# Altium schematic sheet ESP32C3.SchDoc
size A3; SheetNumber: 2; SheetTotal: 3
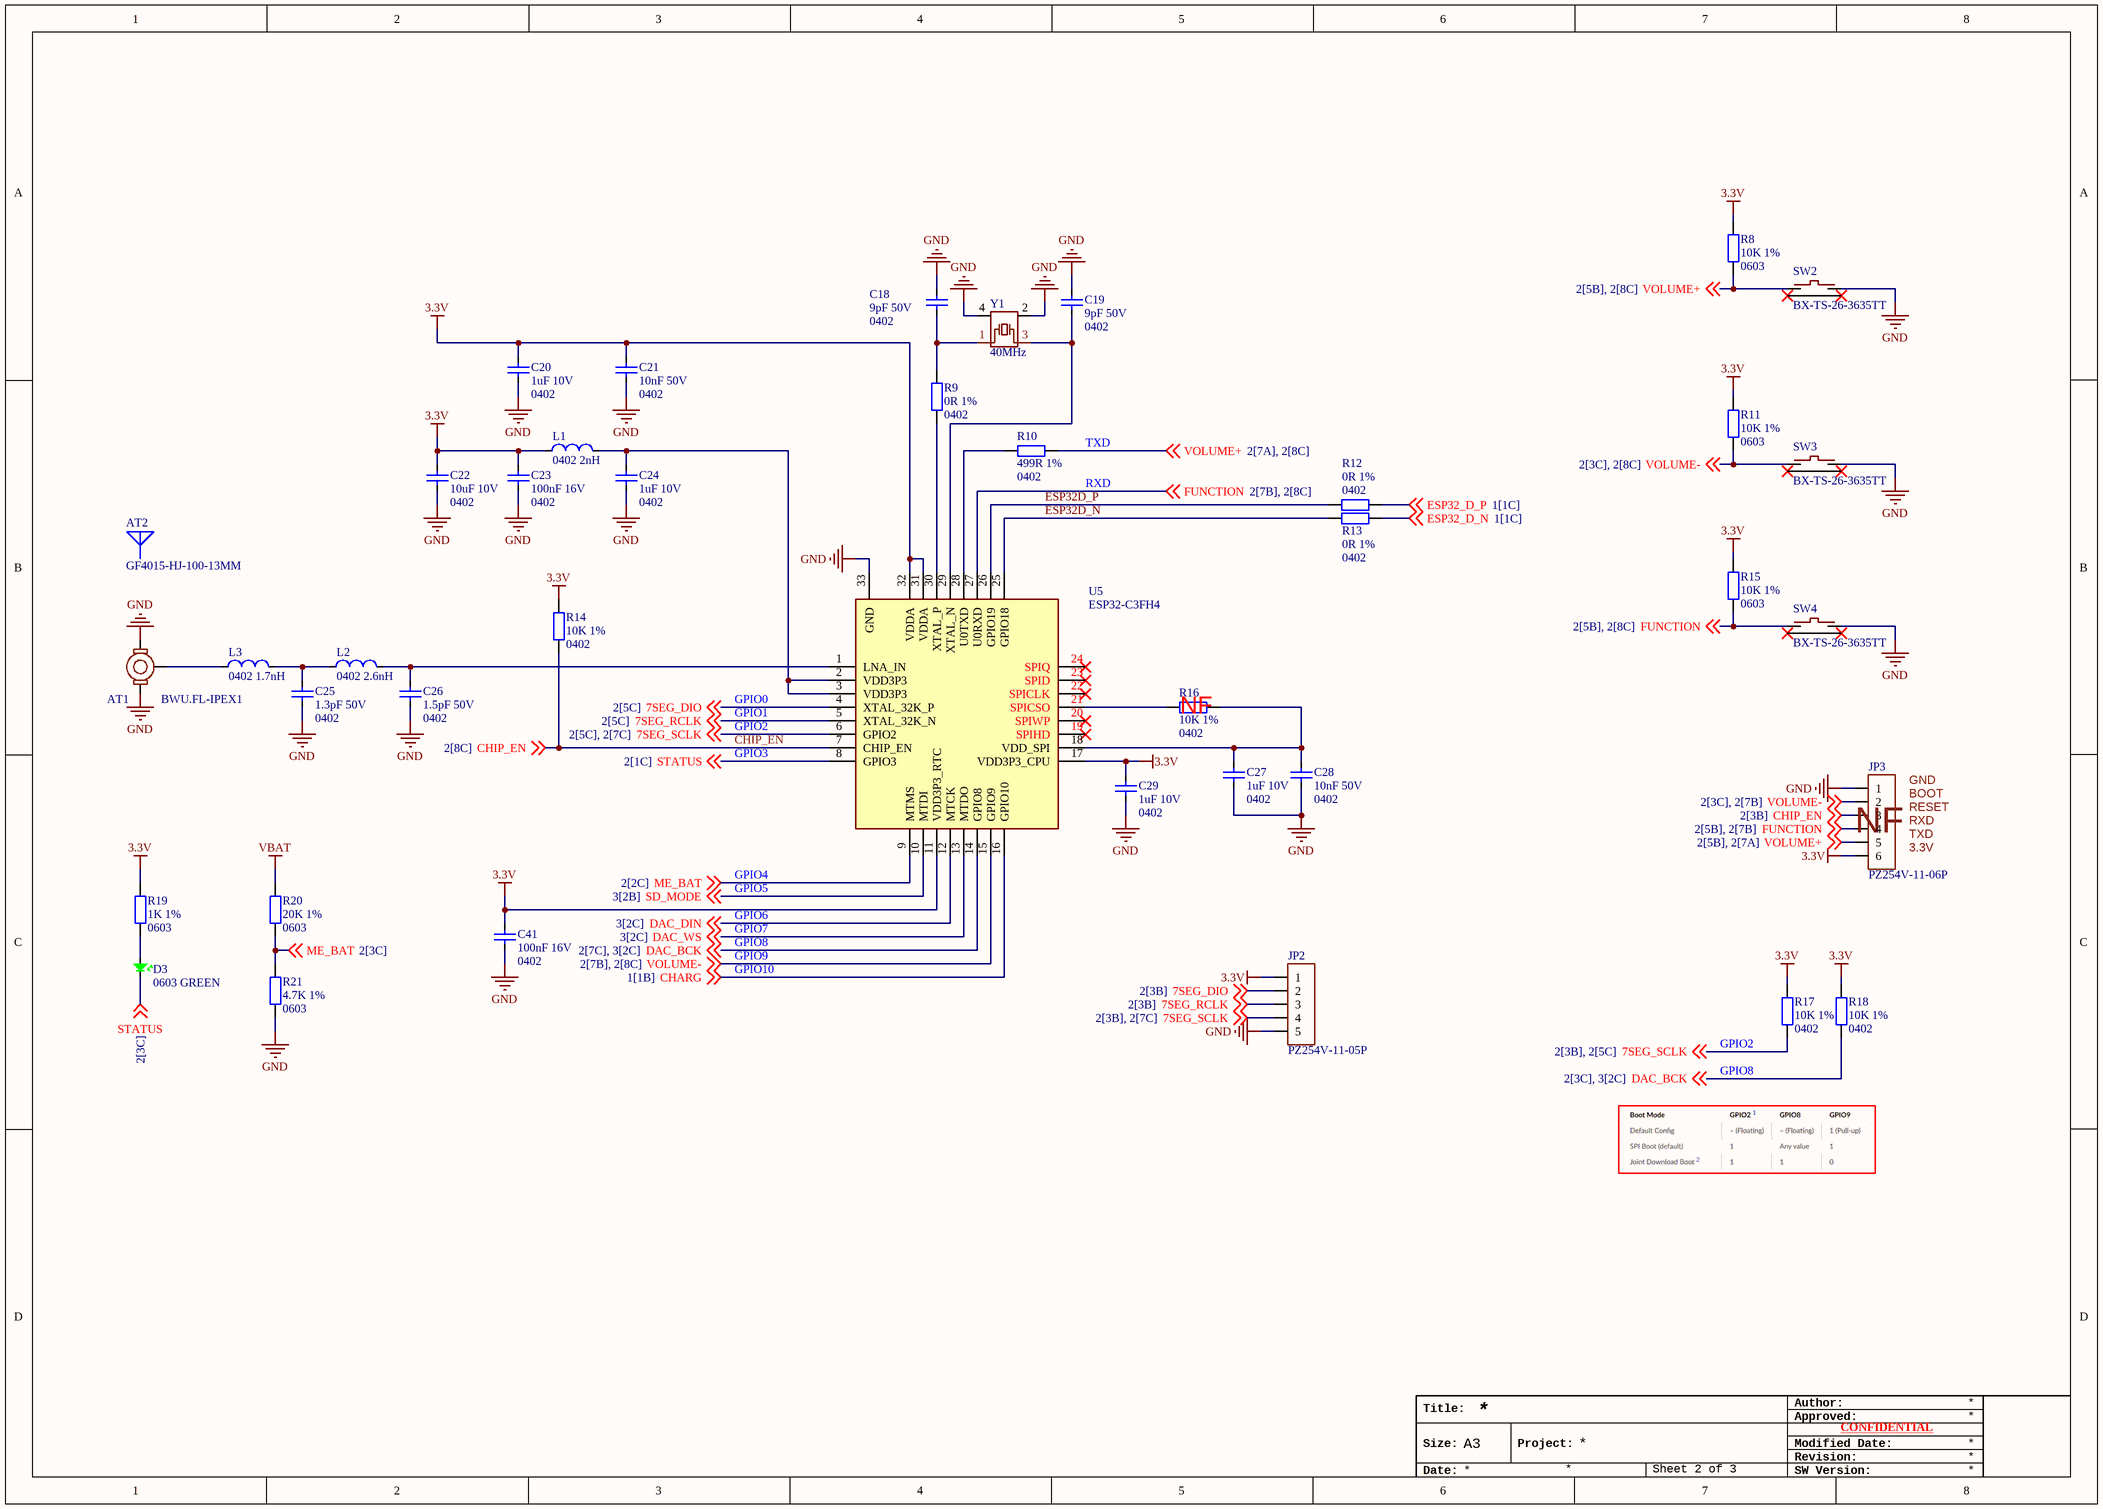
[diagram p0: ESP32C3.SchDoc]

## Parts
AT1  BWU.FL-IPEX1  [IPEX-SMD_BWIPX-1-001E]
AT2  GF4015-HJ-100-13MM  [GF4015-HJ-100-13MM]
C18  9pF 50V  Package: 0402  [C0402_2]
C19  9pF 50V  Package: 0402  [C0402_2]
C20  1uF 10V  Package: 0402  [C0402_2]
C21  10nF 50V  Package: 0402  [C0402_2]
C22  10uF 10V  Package: 0402  [C0402_2]
C23  100nF 16V  Package: 0402  [C0402_2]
C24  1uF 10V  Package: 0402  [C0402_2]
C25  1.3pF 50V  Package: 0402  [C0402_2]
C26  1.5pF 50V  Package: 0402  [C0402_2]
C27  1uF 10V  Package: 0402  [C0402_2]
C28  10nF 50V  Package: 0402  [C0402_2]
C29  1uF 10V  Package: 0402  [C0402_2]
C41  100nF 16V  Package: 0402  [C0402_2]
D3  0603 GREEN  [LED0603_GREEN]
JP2  PZ254V-11-05P  [JP5_M_SMD - 2]
JP3  PZ254V-11-06P  [JP6_M_2]
L1  0402 2nH  [L0402]
L2  0402 2.6nH  [L0402]
L3  0402 1.7nH  [L0402]
R8  10K 1%  Package: 0603  [RES_SMD_0603]
R9  0R 1%  Package: 0402  [RES_SMD_0402]
R10  499R 1%  Package: 0402  [RES_SMD_0402]
R11  10K 1%  Package: 0603  [RES_SMD_0603]
R12  0R 1%  Package: 0402  [RES_SMD_0402]
R13  0R 1%  Package: 0402  [RES_SMD_0402]
R14  10K 1%  Package: 0402  [RES_SMD_0402]
R15  10K 1%  Package: 0603  [RES_SMD_0603]
R16  10K 1%  Package: 0402  [RES_SMD_0402]
R17  10K 1%  Package: 0402  [RES_SMD_0402]
R18  10K 1%  Package: 0402  [RES_SMD_0402]
R19  1K 1%  Package: 0603  [RES_SMD_0603]
R20  20K 1%  Package: 0603  [RES_SMD_0603]
R21  4.7K 1%  Package: 0603  [RES_SMD_0603]
SW2  BX-TS-26-3635TT  [BX-TS-26-3635TT]
SW3  BX-TS-26-3635TT  [BX-TS-26-3635TT]
SW4  BX-TS-26-3635TT  [BX-TS-26-3635TT]
U5  ESP32-C3FH4  [QFN-32_L5.0-W5.0]
Y1  40MHz  [SMD3225-4P]

## Nets
3.3V: C20.2 C21.2 C22.2 C23.2 C29.2 C41.2 JP2.1 JP3.6 L1.1 R8.2 R11.2 R14.2 R15.2 R17.2 R18.2 R19.2 U5.11(VDD3P3_RTC) U5.17(VDD3P3_CPU) U5.31(VDDA) U5.32(VDDA)
GND: AT1.2 C18.2 C19.2 C20.1 C21.1 C22.1 C23.1 C24.1 C25.1 C26.1 C27.1 C28.1 C29.1 C41.1 JP2.5 JP3.1 R21.1 SW2.2 SW3.2 SW4.2 U5.33(GND) Y1.2 Y1.4
VBAT: R20.2
7SEG_DIO: JP2.2 U5.4(XTAL_32K_P) ; off-sheet 7SEG_DIO
7SEG_RCLK: JP2.3 U5.5(XTAL_32K_N) ; off-sheet 7SEG_RCLK
7SEG_SCLK: JP2.4 R17.1 U5.6(GPIO2) ; off-sheet 7SEG_SCLK
CHARG: U5.16(GPIO10) ; off-sheet CHARG
CHIP_EN: JP3.3 R14.1 U5.7(CHIP_EN) ; off-sheet CHIP_EN
DAC_BCK: R18.1 U5.14(GPIO8) ; off-sheet DAC_BCK
DAC_DIN: U5.12(MTCK) ; off-sheet DAC_DIN
DAC_WS: U5.13(MTDO) ; off-sheet DAC_WS
ESP32_D_N: R13.1 ; off-sheet ESP32_D_N
ESP32_D_P: R12.1 ; off-sheet ESP32_D_P
ESP32D_N: R13.2 U5.25(GPIO18)
ESP32D_P: R12.2 U5.26(GPIO19)
FUNCTION: JP3.4 R15.1 SW4.1 U5.27(U0RXD) ; off-sheet FUNCTION
ME_BAT: R20.1 R21.2 U5.9(MTMS) ; off-sheet ME_BAT
SD_MODE: U5.10(MTDI) ; off-sheet SD_MODE
STATUS: D3.2 U5.8(GPIO3) ; off-sheet STATUS
VOLUME+: JP3.5 R8.1 R10.2 SW2.1 ; off-sheet VOLUME+
VOLUME-: JP3.2 R11.1 SW3.1 U5.15(GPIO9) ; off-sheet VOLUME-
NetAT1_1: AT1.1 L3.1
NetC18_1: C18.1 R9.2 Y1.1
NetC19_1: C19.1 U5.29(XTAL_N) Y1.3
NetC24_2: C24.2 L1.2 U5.2(VDD3P3) U5.3(VDD3P3)
NetC25_2: C25.2 L2.1 L3.2
NetC26_2: C26.2 L2.2 U5.1(LNA_IN)
NetC27_2: C27.2 C28.2 R16.2 U5.18(VDD_SPI)
NetD3_1: D3.1 R19.1
NetR9_1: R9.1 U5.30(XTAL_P)
NetR10_1: R10.1 U5.28(U0TXD)
NetR16_1: R16.1 U5.21(SPICSO)

Not connected (* = marked no-connect by the designer): SW2 3* 4*; SW3 3* 4*; SW4 3* 4*; U5 19(SPIHD)* 20(SPIWP)* 22(SPICLK)* 23(SPID)* 24(SPIQ)*

## Notes on the sheet
- (near R10) TXD
- (near R10) RXD
- GPIO0
- GPIO1
- (near R16) NF
- GPIO2
- GPIO3
- (near JP3) GND
- (near JP3) NF
- (near JP3) BOOT
- (near JP3) RESET
- (near JP3) RXD
- (near JP3) TXD
- (near JP3) 3.3V
- GPIO4
- GPIO5
- GPIO6
- GPIO7
- GPIO8
- GPIO9
- GPIO10
- (near R17) GPIO2
- Author:
- Title:
- Size:
- A3
- Project:
- Approved:
- Revision:
- Modified Date:
- CONFIDENTIAL
- Date:
- SW Version:

## Library data of the parts
AT1 = BAT WIRELESS BWU.FL-IPEX1: 1 Inner pin IPEX Board-End 1.25mm 6GHz 50Ω 2mm SMD Coaxial Connectors (RF) ROHS; Manufacturer: BAT WIRELESS; Manufacture Part Number: BWU.FL-IPEX1; Packaging: Cut Tape; Package: SMD; Link: https://www.lcsc.com/product-detail/Coaxial-Connectors-RF_BAT-WIRELESS-BWU-FL-IPEX1_C5137195.html?s_z=n_IPEX; LCSC Part: C5137195
AT2 = GF4015-HJ-100-13MM: Ipex 2.4Ghz Antenna; Manufacturer: Fudong; Manufacture Part Number: GF4015-HJ-100-13MM
C18 C19 = C0402_MLCC_9pF_50V: 50V 9pF C0G 0402 Multilayer Ceramic Capacitors MLCC - SMD/SMT ROHS; Manufacturer: FH (Guangdong Fenghua Advanced Tech); Manufacture Part Number: 0402CG9R0C500NT; Tolerance: ±0.1pF; Packaging: Cut Tape (CT); Link: https://www.lcsc.com/product-detail/Multilayer-Ceramic-Capacitors-MLCC-SMD-SMT_FH-Guangdong-Fenghua-Advanced-Tech-0402CG9R0C500NT_C1580.html?s_z=n_0402%209pF; LCSC Part: C1580
C20 C24 C27 C29 = C0402_MLCC_1uF_10V: 10V 1uF X5R ±10% 0402 Multilayer Ceramic Capacitors MLCC - SMD/SMT ROHS; Manufacturer: Samsung Electro-Mechanics; Manufacture Part Number: CL05A105KP5NNNC; Packaging: Cut Tape (CT); Tolerance: ±10%; Link: https://www.lcsc.com/product-detail/Multilayer-Ceramic-Capacitors-MLCC-SMD-SMT_Samsung-Electro-Mechanics-CL05A105KP5NNNC_C14445.html?s_z=n_0402%201uF; LCSC Part: C14445
C21 C28 = C0402_MLCC_10nF_50V: 50V 10nF X7R ±5% 0402 Multilayer Ceramic Capacitors MLCC - SMD/SMT ROHS; Manufacturer: FH (Guangdong Fenghua Advanced Tech); Manufacture Part Number: 0402B103J500NT; Packaging: Cut Tape (CT); Tolerance: ±5%; Link: https://www.lcsc.com/product-detail/Multilayer-Ceramic-Capacitors-MLCC-SMD-SMT_FH-Guangdong-Fenghua-Advanced-Tech-0402B103J500NT_C2894324.html?s_z=n_10nF%2050V%200402; LCSC Part: C2894324
C22 = C0402_MLCC_10uF_10V: 10V 10uF X5R ±20% 0402 Multilayer Ceramic Capacitors MLCC - SMD/SMT ROHS; Manufacturer: Samsung Electro-Mechanics; Manufacture Part Number: CL05A106MP5NUNC; Packaging: Cut Tape (CT); Tolerance: ±20%; Link: https://www.lcsc.com/product-detail/Multilayer-Ceramic-Capacitors-MLCC-SMD-SMT_Samsung-Electro-Mechanics-CL05A106MP5NUNC_C315248.html?s_z=n_10uF%2050V%200402; LCSC Part: C315248
C23 C41 = C0402_MLCC_100nF_16V: 16V 100nF X7R ±10% 0402 Multilayer Ceramic Capacitors MLCC - SMD/SMT ROHS; Manufacturer: YAGEO; Manufacture Part Number: CC0402KRX7R7BB104; Packaging: Cut Tape (CT); Tolerance: ±10%; Link: https://www.lcsc.com/product-detail/Multilayer-Ceramic-Capacitors-MLCC-SMD-SMT_YAGEO-CC0402KRX7R7BB104_C60474.html?s_z=n_0402%20100nF; LCSC Part: C60474
C25 = C0402_MLCC_1.3pF_50V: 50V 1.3pF C0G 0402 Multilayer Ceramic Capacitors MLCC - SMD/SMT ROHS; Manufacturer: Murata Electronics; Manufacture Part Number: GJM1555C1H1R3WB01D; Tolerance: ±0.1pF; Packaging: Cut Tape (CT); Link: https://lcsc.com/product-detail/Multilayer-Ceramic-Capacitors-MLCC-SMD-SMT_Murata-Electronics-GJM1555C1H1R3WB01D_C88880.html?s_z=n_0402%25201.3pF; LCSC Part: C88880
C26 = C0402_MLCC_1.5pF_50V: 50V 1.5pF NP0 0402 Multilayer Ceramic Capacitors MLCC - SMD/SMT ROHS; Manufacturer: Walsin Tech Corp; Manufacture Part Number: RF15N1R5B500CT; Tolerance: ±0.1pF; Packaging: Cut Tape (CT); Link: https://www.lcsc.com/product-detail/Multilayer-Ceramic-Capacitors-MLCC-SMD-SMT_Walsin-Tech-Corp-RF15N1R5B500CT_C338137.html?s_z=n_0402%201.5pF; LCSC Part: C338137
D3 = L0603_GREEN: 225mcd~450mcd Colorless Transparent Lens -40℃~+85℃ Positive Stick 520nm~535nm Green 120° 70mW 2.4V~3V 0603 LED Indication - Discrete ROHS; Manufacturer: Amicc; Manufacture Part Number: A-SP192DGHC-C01-4T; Packaging: Cut Tape (CT); Link: https://www.lcsc.com/product-detail/LED-Indication-Discrete_Amicc-A-SP192DGHC-C01-4T_C19171301.html?s_z=n_LED%200603%20green; Package: 0603; LCSC Part: C19171301
JP2 = XFCN PZ254V-11-05P: Policy 2.5mm 5P 6mm -40℃~+105℃ 3mm 2.54mm Single Row Black Brass 1x5P Plugin,P=2.54mm Pin Headers ROHS; Manufacturer: XFCN; Manufacture Part Number: PZ254V-11-05P; Packaging: Cut Tape; Link: https://www.lcsc.com/product-detail/Pin-Headers_XFCN-PZ254V-11-05P_C492404.html?s_z=n_XFCN%20PZ254V-11-05P; Package: Plugin,P=2.54mm; LCSC Part: C492404
JP3 = PZ254V-11-06P: 250V 3A Policy 2.5mm 4P 6mm -40℃~+105℃ 3mm 2.54mm Single Row Black 1x4P Plugin,P=2.54mm Pin Headers ROHS; Manufacturer: XFCN; Manufacture Part Number: PZ254V-11-06P; Packaging: Cut Tape; Link: https://www.lcsc.com/product-detail/Pin-Headers_XFCN-PZ254V-11-06P_C492405.html?s_z=n_PZ254V-11-06P; Package: Plugin,P=2.54mm; LCSC Part: C492405
L1 = L0402_2nH_900mA: 900mA 2nH 90mΩ 0402 Inductors (SMD) ROHS; Manufacturer: Murata Electronics; Manufacture Part Number: LQG15HS2N0S02D; Packaging: Cut Tape; Link: https://www.lcsc.com/product-detail/Inductors-SMD_Murata-Electronics-LQG15HS2N0S02D_C18216.html?s_z=n_0402%202nH; Inductor: 2nH; Current: 900mA; Package: 0402; LCSC Part: C18216
L2 = L0402_2.6nH_1.95A: 1.95A 2.6nH 0402 Power Inductors ROHS; Manufacturer: Murata Electronics; Manufacture Part Number: LQW15AN2N6G80D; Packaging: Cut Tape; Link: https://lcsc.com/product-detail/Power-Inductors_Murata-Electronics-LQW15AN2N6G80D_C412268.html?s_z=n_0402%25202.6nH; Inductor: 2.6nH; Current: 1.95A; Package: 0402; LCSC Part: C412268
L3 = L0402_1.7nH_1.15A: 1.15A 1.7nH 0402 Power Inductors ROHS; Manufacturer: Murata Electronics; Manufacture Part Number: LQW15AN1N7C80D; Packaging: Cut Tape; Link: https://lcsc.com/product-detail/Power-Inductors_Murata-Electronics-LQW15AN1N7C80D_C412263.html?s_z=n_0402%25201.7nH; Inductor: 1.7nH; Current: 1.15A; Package: 0402; LCSC Part: C412263
R8 R11 R15 = R0603_10K: 10 kOhms ±1% 0.1W, 1/10W Chip Resistor 0603 (1608 Metric) Moisture Resistant Thick Film; Manufacturer: YAGEO; Manufacture Part Number: RC0603FR-0710KL; Packaging: Cut Tape (CT); Link: https://www.lcsc.com/product-detail/Chip-Resistor-Surface-Mount_YAGEO-RC0603FR-0710KL_C98220.html?s_z=n_RC0603FR-0710KL; Tolerance: ±1%; Link Digikey: https://www.digikey.com/en/products/detail/yageo/RC0603FR-0710KL/726880; LCSC Part: C98220
R9 R12 R13 = R0402_0R: 0 Ohms Jumper Chip Resistor 0402 (1005 Metric) Moisture Resistant Thick Film; Manufacturer: YAGEO; Manufacture Part Number: RC0402JR-070RL; Packaging: Cut Tape (CT); Link: https://www.lcsc.com/product-detail/Chip-Resistor-Surface-Mount_YAGEO-RC0402JR-070RL_C60485.html?s_z=n_RC0402JR-070RL; Tolerance: ±1%; Link Digikey: https://www.digikey.com/en/products/detail/yageo/RC0402JR-070RL/726406; LCSC Part: C60485
R10 = R0402_499R: 499 Ohms ±1% 0.063W, 1/16W Chip Resistor 0402 (1005 Metric) Moisture Resistant Thick Film; Manufacturer: YAGEO; Manufacture Part Number: RC0402FR-13499RL; Packaging: Cut Tape (CT); Link: https://www.lcsc.com/product-detail/Chip-Resistor-Surface-Mount_YAGEO-RC0402FR-13499RL_C5716867.html?s_z=n_RC0402FR-13499RL; Tolerance: ±1%; Link Digikey: https://www.digikey.com/en/products/detail/yageo/RC0402FR-13499RL/16982107; LCSC Part: C5716867
R14 R16-R18 = R0402_10K: 10 kOhms ±1% 0.063W, 1/16W Chip Resistor 0402 (1005 Metric) Moisture Resistant Thick Film; Manufacturer: YAGEO; Manufacture Part Number: RC0402FR-0710KL; Packaging: Cut Tape (CT); Link: https://www.lcsc.com/product-detail/Chip-Resistor-Surface-Mount_YAGEO-RC0402FR-0710KL_C60490.html?s_z=n_RC0402FR-0710KL; Tolerance: ±1%; Link Digikey: https://www.digikey.com/en/products/detail/yageo/RC0402FR-0710KL/726523; LCSC Part: C60490
R19 = R0603_1K: 1 kOhms ±1% 0.1W, 1/10W Chip Resistor 0603 (1608 Metric) Moisture Resistant Thick Film; Manufacturer: YAGEO; Manufacture Part Number: RC0603FR-071KL; Packaging: Cut Tape (CT); Link: https://www.lcsc.com/product-detail/Chip-Resistor-Surface-Mount_YAGEO-RC0603FR-071KL_C22548.html?s_z=n_RC0603FR-071KL; Tolerance: ±1%; Link Digikey: https://www.digikey.com/en/products/detail/yageo/RC0603FR-071KL/726843; LCSC Part: C22548
R20 = R0603_20K: 100mW Thick Film Resistors 75V ±100ppm/℃ ±1% 20kΩ 0603 Chip Resistor - Surface Mount ROHS; Manufacturer: YAGEO; Manufacture Part Number: RC0603FR-0720KL; Packaging: Cut Tape (CT); Link: https://www.lcsc.com/product-detail/Chip-Resistor-Surface-Mount_YAGEO-RC0603FR-0720KL_C105575.html?s_z=n_RC0603FR-0720KL; Tolerance: ±1%; Link Digikey: https://www.digikey.com/en/products/detail/yageo/RC0603FR-0720KL/727040; LCSC Part: C105575
R21 = R0603_4.7K: 4.7 kOhms ±1% 0.1W, 1/10W Chip Resistor 0603 (1608 Metric) Moisture Resistant Thick Film; Manufacturer: YAGEO; Manufacture Part Number: RC0603FR-074K7L; Packaging: Cut Tape (CT); Link: https://www.lcsc.com/product-detail/Chip-Resistor-Surface-Mount_YAGEO-RC0603FR-074K7L_C99782.html?s_z=n_RC0603FR-074K7L; Tolerance: ±1%; Link Digikey: https://www.digikey.com/en/products/detail/yageo/RC0603FR-074K7L/727212; LCSC Part: C99782
SW2-SW4 = BX-TS-26-3635TT: Without bracket 50mA 3.6mm 100000 Times 260gf 12V 3.5mm 3.5mm Rectangle button Standing paste SPST SMD,3x6mm Tactile Switches ROHS; Manufacturer: Bossie; Manufacture Part Number: C18078107; Packaging: Cut Tape; Link: https://www.lcsc.com/product-detail/Tactile-Switches_Bossie-BX-TS-26-3635TT_C18078107.html?s_z=n_tactile; Package: SMD,3x6mm; LCSC Part: C18078107
U5 = ESP32-C3FH4: QFN-32-EP(5x5) Microcontrollers (MCU/MPU/SOC) ROHS; Manufacturer: Espressif Systems; Manufacture Part Number: ESP32-C3FH4; Packaging: Cut Tape (CT); Link: https://www.lcsc.com/product-detail/Microcontrollers-MCU-MPU-SOC_Espressif-Systems-ESP32-C3FH4_C2858491.html?s_z=n_esp32c3h4; Package: QFN-32-EP(5x5); LCSC Part: C2858491
Y1 = 40Mhz-3225-4P: 40MHz Surface Mount Crystal 9pF ±10ppm ±10ppm SMD3225-4P Crystals ROHS; Manufacturer: TOGNJING; Manufacture Part Number: XTM32040000FT00351001; Packaging: Cut Tape (CT); Link: https://www.lcsc.com/product-detail/Crystals_TOGNJING-XTM32040000FT00351001_C37635390.html?s_z=n_40mhz; Package: SMD3225-4P; LCSC Part: C37635390